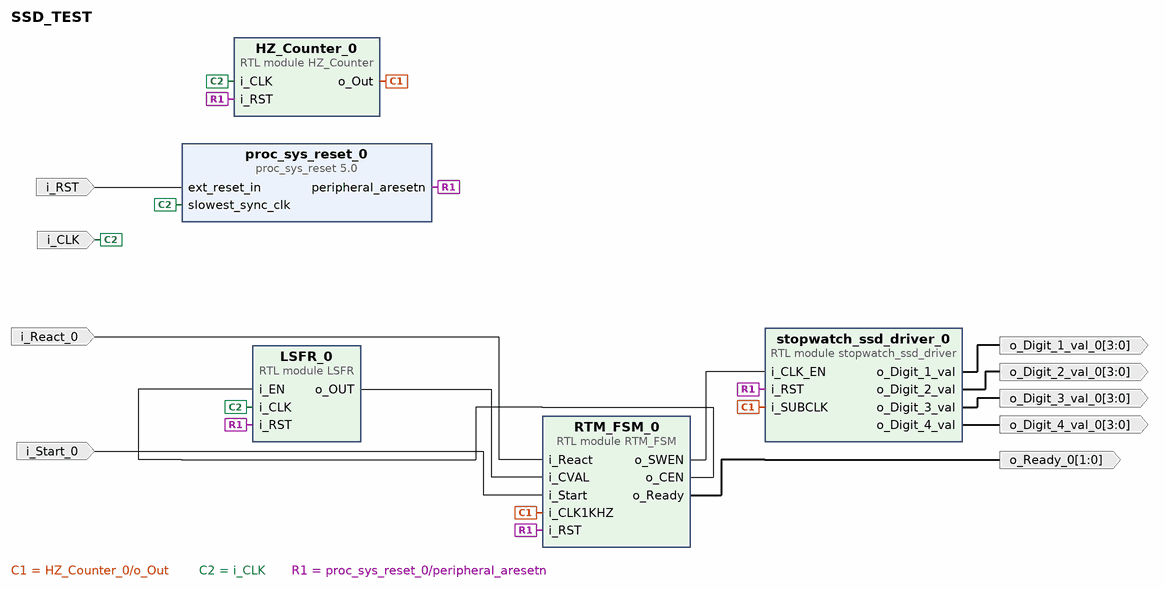
[diagram p0: block diagram of the top level]
# Vivado block design SSD_TEST, xc7z007sclg400-1, Vivado 2018.2
create_bd_design SSD_TEST

create_bd_port -dir I -type clk i_CLK
create_bd_port -dir I -type rst i_RST
set_property -dict {CONFIG.POLARITY ACTIVE_LOW} [get_bd_ports i_RST]
create_bd_port -dir I i_React_0
create_bd_port -dir I i_Start_0
create_bd_port -dir O -from 1 -to 0 o_Ready_0
create_bd_port -dir O -from 3 -to 0 o_Digit_2_val_0
create_bd_port -dir O -from 3 -to 0 o_Digit_3_val_0
create_bd_port -dir O -from 3 -to 0 o_Digit_4_val_0
create_bd_port -dir O -from 3 -to 0 o_Digit_1_val_0

create_bd_cell -type module -reference HZ_Counter HZ_Counter_0
set_property -dict {CONFIG.c_NUM 50000} [get_bd_cells HZ_Counter_0]
create_bd_cell -type ip -vlnv xilinx.com:ip:proc_sys_reset:5.0 proc_sys_reset_0
create_bd_cell -type module -reference stopwatch_ssd_driver stopwatch_ssd_driver_0
create_bd_cell -type module -reference LSFR LSFR_0
create_bd_cell -type module -reference RTM_FSM RTM_FSM_0

# ---- connections ----

connect_bd_net [get_bd_pins HZ_Counter_0/o_Out] [get_bd_pins stopwatch_ssd_driver_0/i_SUBCLK] [get_bd_pins RTM_FSM_0/i_CLK1KHZ]
connect_bd_net [get_bd_pins LSFR_0/o_OUT] [get_bd_pins RTM_FSM_0/i_CVAL]
connect_bd_net [get_bd_pins RTM_FSM_0/o_CEN] [get_bd_pins LSFR_0/i_EN]
connect_bd_net [get_bd_pins RTM_FSM_0/o_SWEN] [get_bd_pins stopwatch_ssd_driver_0/i_CLK_EN]
connect_bd_net [get_bd_ports i_CLK] [get_bd_pins HZ_Counter_0/i_CLK] [get_bd_pins proc_sys_reset_0/slowest_sync_clk] [get_bd_pins LSFR_0/i_CLK]
connect_bd_net [get_bd_ports i_RST] [get_bd_pins proc_sys_reset_0/ext_reset_in]
connect_bd_net -net i_React_0_1 [get_bd_ports i_React_0] [get_bd_pins RTM_FSM_0/i_React]
connect_bd_net -net i_Start_0_1 [get_bd_ports i_Start_0] [get_bd_pins RTM_FSM_0/i_Start]
connect_bd_net [get_bd_pins proc_sys_reset_0/peripheral_aresetn] \
  [get_bd_pins HZ_Counter_0/i_RST] [get_bd_pins stopwatch_ssd_driver_0/i_RST] [get_bd_pins LSFR_0/i_RST] \
  [get_bd_pins RTM_FSM_0/i_RST]
connect_bd_net [get_bd_pins RTM_FSM_0/o_Ready] [get_bd_ports o_Ready_0]
connect_bd_net [get_bd_pins stopwatch_ssd_driver_0/o_Digit_2_val] [get_bd_ports o_Digit_2_val_0]
connect_bd_net [get_bd_pins stopwatch_ssd_driver_0/o_Digit_3_val] [get_bd_ports o_Digit_3_val_0]
connect_bd_net [get_bd_pins stopwatch_ssd_driver_0/o_Digit_4_val] [get_bd_ports o_Digit_4_val_0]
connect_bd_net [get_bd_pins stopwatch_ssd_driver_0/o_Digit_1_val] [get_bd_ports o_Digit_1_val_0]

validate_bd_design
save_bd_design
